# EAGLE design pt100-daughterboard (EAGLE 5.11)
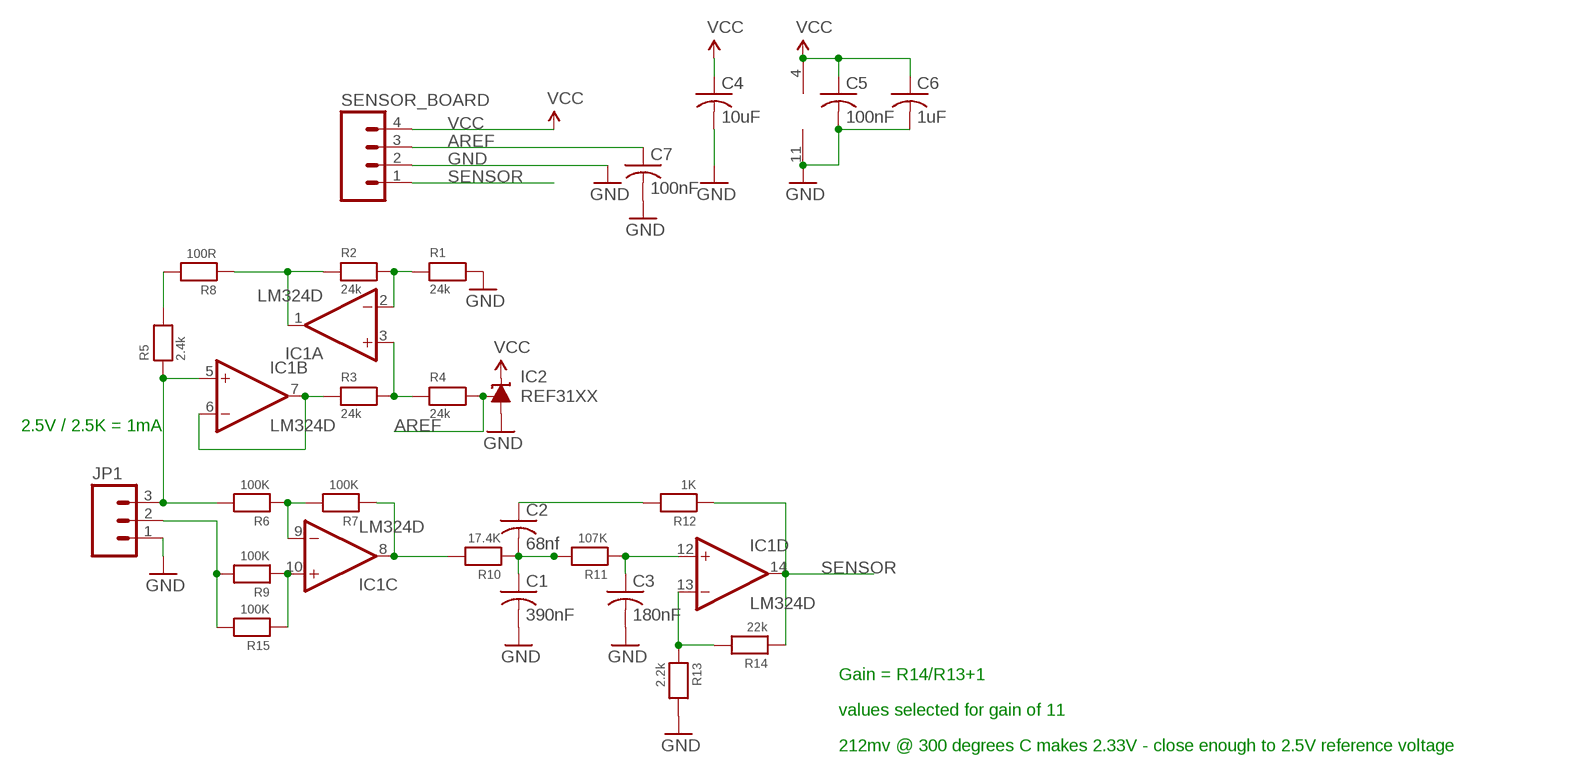
[diagram p0: schematic, sheet 1]

## Parts
C1  390nF  C-USC0603  [C0603]
C2  68nf  C-USC0603  [C0603]
C3  180nF  C-USC0603  [C0603]
C4  10uF  C-USC0805  [C0805]
C5  100nF  C-USC0603  [C0603]
C6  1uF  C-USC0603  [C0603]
C7  100nF  C-USC0603  [C0603]
IC1  LM324D  [SO14]
IC2  REF31XX  [DBZ_R-PDSO-G3]
JP1  M03LONGPADS  [1X03_LONGPADS]
R1  24k  RESISTOR0603  [0603]
R2  24k  RESISTOR0603  [0603]
R3  24k  RESISTOR0603  [0603]
R4  24k  RESISTOR0603  [0603]
R5  2.4k  RESISTOR0603  [0603]
R6  100K  RESISTOR0603  [0603]
R7  100K  RESISTOR0603  [0603]
R8  100R  RESISTOR0603  [0603]
R9  100K  RESISTOR0603  [0603]
R10  17.4K  RESISTOR0603  [0603]
R11  107K  RESISTOR0603  [0603]
R12  1K  RESISTOR0603  [0603]
R13  2.2k  RESISTOR0603  [0603]
R14  22k  RESISTOR0603  [0603]
R15  100K  RESISTOR0603  [0603]
SENSOR_BOARD  M04  [04P]

## Nets
AREF: C7.1 IC2.2(OUT) R4.2 SENSOR_BOARD.3
GND: C1.2 C3.2 C4.2 C5.2 C6.2 C7.2 IC1.11(P:V-) IC2.3(GND) JP1.1 R1.2 R13.2 SENSOR_BOARD.2
N$1: IC1.2(A:-IN) R1.1 R2.2
N$2: IC1.1(A:OUT) R2.1 R8.1
N$3: IC1.3(A:+IN) R3.2 R4.1
N$4: IC1.6(B:-IN) IC1.7(B:OUT) R3.1
N$5: IC1.5(B:+IN) JP1.3 R5.1 R6.2
N$6: IC1.9(C:-IN) R6.1 R7.2
N$7: IC1.8(C:OUT) R7.1 R10.2
N$8: IC1.10(C:+IN) R9.1 R15.1
N$9: JP1.2 R9.2 R15.2
N$11: IC1.13(D:-IN) R13.1 R14.2
N$12: C1.1 C2.2 R10.1 R11.2
N$13: C3.1 IC1.12(D:+IN) R11.1
N$14: C2.1 R12.2
N$30: R5.2 R8.2
SENSOR: IC1.14(D:OUT) R12.1 R14.1 SENSOR_BOARD.1
VCC: C4.1 C5.1 C6.1 IC1.4(P:V+) IC2.1(IN) SENSOR_BOARD.4

## Notes on the sheet
- 2.5V / 2.5K = 1mA
- Gain = R14/R13+1
- values selected for gain of 11
- 212mv @ 300 degrees C makes 2.33V - close enough to 2.5V reference voltage

## Library data of the parts
C1-C7 = adafruit:C-US: CAPACITOR, American symbol
IC1 = linear:LM324: OP AMP
IC2 = mic-misc:REF31XX: 20ppm/Degrees C Max, 100uA, SOT23-3 Series Voltage Reference http://www.ti.com/lit/gpn/ref3125
JP1 = SparkFun:M03: Header 3 Standard 3-pin 0.1" header. Use with straight break away headers (SKU : PRT-00116), right angle break away headers (PRT-00553), swiss pins (PRT-00743), machine pins (PRT-00117), and female headers (PRT-00115). Molex polarized connector foot print use with SKU : PRT-08232 with associated crimp pins and housings.
R1-R15 = microbuilder:RESISTOR: Resistors 0402 - 0402 Surface Mount Package 22 Ohm 1% 1/16W [Digikey: 311-22.0LRTR-ND] 33 Ohm 5% 1/16W 1.0K 5% 1/16W 1.5K 5% 1/16W 2.0K 1% 1/16W 10.0K 1% 1/16W [Digikey: 311-10.0KLRTR-ND] 10.0K 5% 1/16W [Digikey: RMCF0402JT10K0TR-ND] 12.1K 1% 1/16W [Digikey: 311-22.0LRTR-ND] 100.0K 5% 1/16W 0603 - 0603 Surface Mount Package 0 Ohm 1/10 Watt 1% Resistor 15 Ohm 1/10 Watt 1% Resistor 33 Ohm 1/10 Watt 1% Resistor 49.9 Ohm 1/10 Watt 1% Resistor 100 Ohm 1/10 Watt 1% Resistor 150 Ohm 1/10 Watt 1% Resistor 240 Ohm 1/10 Watt 1% Resistor 390 Ohm 1/10 Watt 1% Resistor 560 Ohm 1/10 Watt 1% Resistor 680 Ohm 1/10 Watt 1% Resistor 750 Ohm 1/10 Watt 1% Resistor 1.0K Ohm 1/10 Watt 1% Resistor 1.5K Ohm 1/10 Watt 1% Resistor 2.0K Ohm 1/10 Watt 1% Resistor 2.2K Ohm 1/10 Watt 1% Resistor 3.3K Ohm 1/10 Watt 1% Resistor 4.7K Ohm 1/10 Watt 1% Resistor 10.0K Ohm 1/10 Watt 1% Resistor 12.0K Ohm 1/10 Watt 1% Resistor 12.1K Ohm 1/10 Watt 1% Resistor 20.0K Ohm 1/10 Watt 1% Resistor 33.0K Ohm 1/10 Watt 1% Resistor 100.0K Ohm 1/10 Watt 1% Resistor 0805 - 0805 Surface Mount Package 0 Ohm 1/8 Watt 1% Resistor 33 Ohm 1/8 Watt 1% Resistor 100 Ohm 1/8 Watt 1% Resistor 150 Ohm 1/8 Watt 1% Resistor 200 Ohm 1/8 Watt 1% Resistor 240 Ohm 1/8 Watt 1% Resistor 330 Ohm 1/8 Watt 1% Resistor 390 Ohm 1/8 Watt 1% Resistor 470 Ohm 1/8 Watt 1% Resistor 1.0K Ohm 1/8 Watt 1% Resistor 1.5K Ohm 1/8 Watt 1% Resistor 2.0K Ohm 1/8 Watt 1% Resistor 4.7K Ohm 1/8 Watt 1% Resistor 5.1K Ohm 1/8 Watt 1% Resistor 5.6K Ohm 1/8 Watt 1% Resistor 10.0K Ohm 1/8 Watt 1% Resistor 22.0K Ohm 1/8 Watt 1% Resistor 33.0K Ohm 1/8 Watt 1% Resistor 100K Ohm 1/8 Watt 1% Resistor 1206 - 1206 Surface Mount Package 2012 - 2010 Surface Mount Package 0.11 Ohm 1/2 Watt 1% Resistor - Digikey: RHM.11UCT-ND
SENSOR_BOARD = con-amp-quick:M04: AMP QUICK CONNECTOR; OC_FARNELL: unknown; OC_NEWARK: unknown

## Board
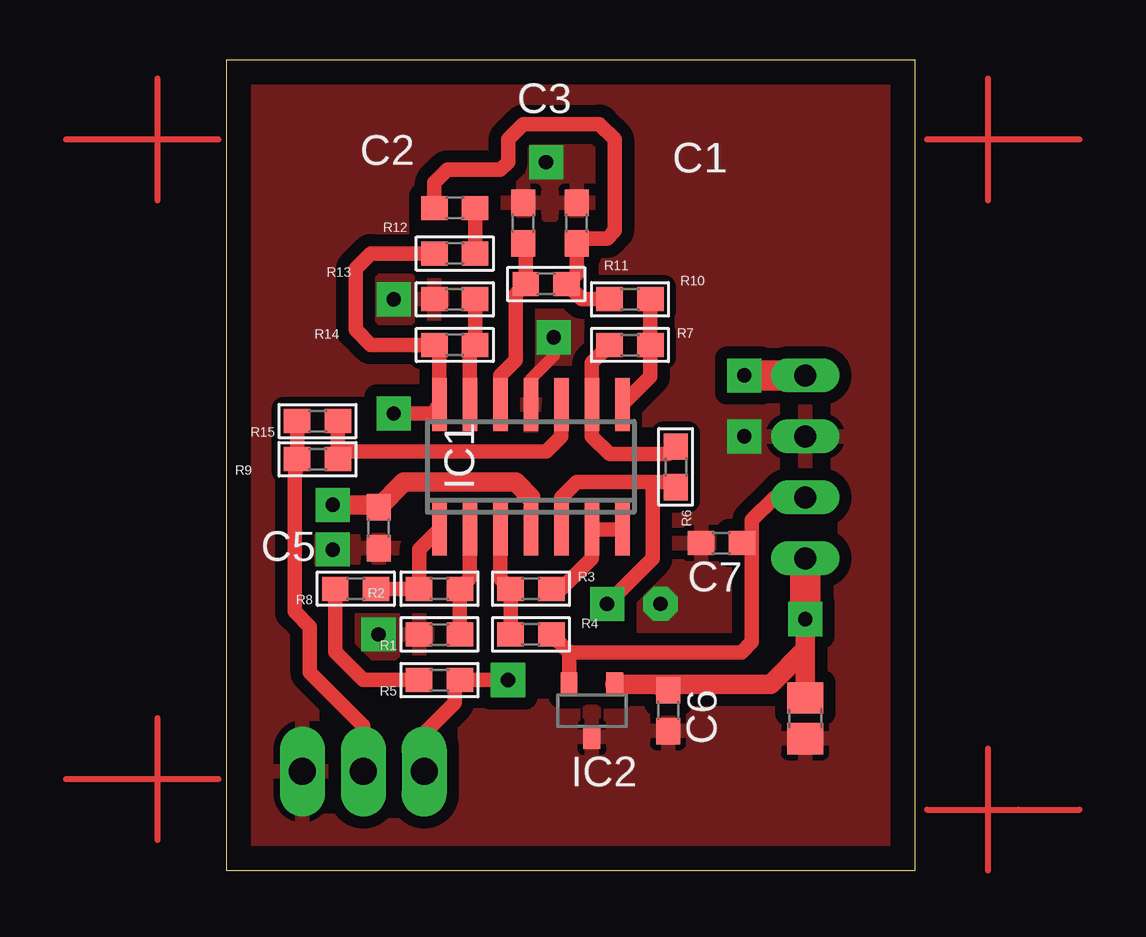
[diagram p1: board, top side]
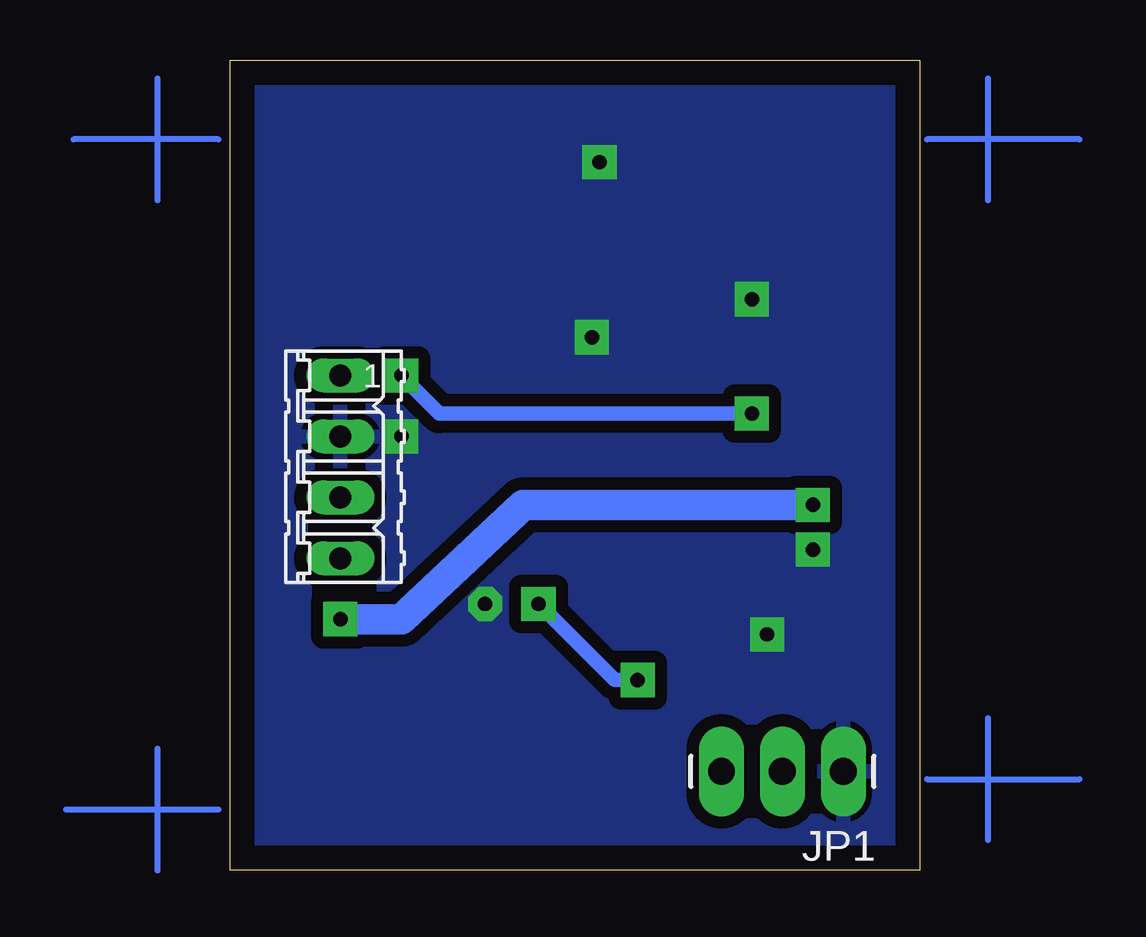
[diagram p2: board, bottom side, seen from below]

Size 28.71 x 33.79 mm. Coordinates in mm from the lower left corner, seen from the top.
Outline: 0,0 28.71,0 28.71,33.79 0,33.79 0,0
Copper layers (1*16): Top 0.035mm / dielectric 1.5mm / Bottom 0.035mm
Design rules "default *": minimum track width 10mil, minimum drill 24mil, track to track 16mil, track to pad 16mil, pad to pad 16mil, via to via 16mil, smd to smd 8mil, copper to edge 40mil, drill to drill 8mil, minimum pad ring 10mil, minimum via ring 8mil, stop-mask expansion 4mil, vias tented up to drill 0mil, thermal gap 10mil

### Footprints (pad centres in the part's own frame; a part is rotated, then mirrored left to right if it is on the bottom)
C0603 = smd 1.1 x 1: 1 -0.85,0; 2 0.85,0
C0805 = smd 1.3 x 1.5: 1 -0.85,0; 2 0.85,0
SO14 = smd 0.6 x 2.2: 1 -3.81,-2.6; 2 -2.54,-2.6; 3 -1.27,-2.6; 4 0,-2.6; 5 1.27,-2.6; 6 2.54,-2.6; 7 3.81,-2.6; 8 3.81,2.6; 9 2.54,2.6; 10 1.27,2.6; 11 0,2.6; 12 -1.27,2.6; 13 -2.54,2.6; 14 -3.81,2.6
DBZ_R-PDSO-G3 = smd 0.7 x 1: 1 -0.95,-1.1; 2 0.95,-1.1; 3 0,1.1
1X03_LONGPADS = drill 1.118 pad 1.88 long: 1 0,0; 2 2.54,0; 3 5.08,0
0603 = smd 1.1 x 1: 1 -0.85,0; 2 0.85,0
04P = drill 0.914 long: 1 -3.81,0; 2 -1.27,0; 3 1.27,0; 4 3.81,0

### Placement (x,y rotation side)
C1  14.61,26.99 90 top
C2  9.53,27.62 180 top
C3  12.38,26.99 90 top
C4  24.13,6.35 270 top
C5  6.35,14.29 270 top
C6  18.41,6.67 270 top
C7  20.64,13.65 180 top
IC1  12.7,16.83 0 top
IC2  15.24,6.67 180 top
JP1  3.17,4.13 180 bottom
R1  8.89,9.84 180 top
R2  8.89,11.75 0 top
R3  12.7,11.75 180 top
R4  12.7,9.84 0 top
R5  8.89,7.94 180 top
R6  18.73,16.83 270 top
R7  16.83,21.91 180 top
R8  5.4,11.75 180 top
R9  3.81,17.14 180 top
R10  16.83,23.81 0 top
R11  13.34,24.45 0 top
R12  9.53,25.72 0 top
R13  9.53,23.81 180 top
R14  9.53,21.91 0 top
R15  3.81,18.73 180 top
SENSOR_BOARD  24.13,16.83 270 bottom

### Tracks (layer width: path | path; a pad name or v marks a point on that pad's centre or on a via)
AREF
  Top 0.61: IC2.2 14.29,9.1 | 14.29,9.1 R4.2 | 14.29,9.1 21.48,9.1 21.91,9.53 21.91,13.97 | 21.91,13.97 21.91,14.61 22.86,15.56 SENSOR_BOARD.3 | C7.1 21.59,13.65 21.91,13.97
GND  (via drill 0.6 pad 1.42)
  Top 0.508: IC1.11 12.7,20.5 13.67,21.47 13.67,22.21 v13.65,22.23
  other vias: 6.99,23.81 13.34,29.53 6.35,9.84 4.45,13.38 21.59,18.1 18.1,11.11
  pour Top (isolate 0.508): -1.27,34.29 29.21,34.29 29.21,0 -1.27,0
  pour Bottom (isolate 0.508): -1.27,34.29 29.21,34.29 29.21,0 -1.27,0
N$1
  Top 0.61: IC1.2 10.16,12.17 R2.2 R1.1
N$2
  Top 0.61: IC1.1 8.04,13.38 R2.1 R8.1
N$3
  Top 0.61: IC1.3 11.43,12.17 R3.2 R4.1
N$4
  Top 0.61: R3.1 13.97,11.75 15.24,13.02 IC1.6 IC1.7
N$5  (via drill 0.6 pad 1.42)
  Top 0.61: IC1.5 13.97,15.56 14.61,16.19 17.78,16.19 | 17.78,16.19 18.84,16.19 R6.2 | v11.75,7.94 R5.1 9.53,7.72 9.53,6.99 8.26,5.71 JP1.3 | v15.88,11.11 17.78,13.02 17.78,16.19
  Bottom 0.61: v11.75,7.94 12.7,7.94 v15.88,11.11
N$6
  Top 0.61: R7.2 15.24,21.17 IC1.9 15.24,18.1 15.98,17.36 18.41,17.36 R6.1
N$7
  Top 0.61: IC1.8 17.68,20.59 R7.1 R10.2
N$8
  Top 0.61: IC1.10 13.97,18.1 13.34,17.46 4.76,17.46 4.66,17.36 | R9.1 4.66,17.36 | 4.66,17.36 R15.1
N$9
  Top 0.61: JP1.2 5.71,6.03 3.49,8.26 3.49,10.16 2.86,10.79 2.86,16.41 R9.2 R15.2
N$10
  Top 0.254: -2.86,27.94 -2.86,33.02
N$11
  Top 0.61: IC1.13 10.16,21.69 R14.2 R13.1
N$12
  Top 0.61: C2.2 8.68,28.68 9.21,29.21 11.43,29.21 11.75,29.53 11.75,30.48 12.38,31.11 15.56,31.11 16.19,30.48 16.19,26.67 15.88,26.35 14.82,26.35 C1.1 14.61,24.87 R11.2 14.82,23.81 R10.1
N$13
  Top 0.61: C3.1 12.48,26.04 R11.1 12.06,24.03 12.06,21.27 11.43,20.64 IC1.12
N$14
  Top 0.61: C2.1 R12.2
N$15
  Top 0.254: -6.67,30.48 -0.32,30.48
N$16
  Top 0.254: 31.75,27.94 31.75,33.02
N$17
  Top 0.254: 29.21,30.48 31.75,30.48 33.02,30.48 35.56,30.48
N$18
  Top 0.254: -2.86,1.27 -2.86,6.35
N$19
  Top 0.254: -0.32,3.81 -6.67,3.81
N$20
  Top 0.254: 31.75,0 31.75,5.08
N$21
  Top 0.254: 29.21,2.54 31.75,2.54 33.02,2.54 35.56,2.54
N$22
  Bottom 0.254: -2.86,27.94 -2.86,33.02
N$23
  Bottom 0.254: -6.67,30.48 -0.32,30.48
N$24
  Bottom 0.254: -2.86,1.27 -2.86,6.35
N$25
  Bottom 0.254: -0.32,3.81 -6.67,3.81
N$26
  Bottom 0.254: 31.75,0 31.75,5.08
N$27
  Bottom 0.254: 29.21,2.54 35.56,2.54
N$28
  Bottom 0.254: 31.75,27.94 31.75,33.02
N$29
  Bottom 0.254: 29.21,30.48 35.24,30.48
N$30
  Top 0.61: R8.2 4.55,9.11 5.71,7.94 R5.2
SENSOR  (via drill 0.6 pad 1.42)
  Top 0.61: R12.1 6.03,25.72 5.4,25.08 5.4,22.54 6.03,21.91 R14.1 8.89,21.69 IC1.14 8.63,19.05 v6.99,19.05
  Top 1.27: v21.59,20.64 SENSOR_BOARD.1
  Bottom 0.61: v6.99,19.05 20,19.05 v21.59,20.64
VCC  (via drill 0.6 pad 1.42)
  Top 0.508: C6.1 18.03,7.52 17.78,7.77
  Top 0.61: 12.7,15.56 IC1.4 | C5.1 6.25,15.24 | v24.13,10.48 24.13,10.16
  Top 0.813: 12.7,15.56 12.06,16.19 7.41,16.19 C5.1 | 6.25,15.24 v4.45,15.24 | IC2.1 17.78,7.77 22.69,7.77 24.13,9.21 | 24.13,10.16 24.13,9.21 | 24.13,9.21 C4.1
  Top 1.27: v24.13,10.48 SENSOR_BOARD.4
  Bottom 1.27: v4.45,15.24 16.51,15.24 21.59,10.48 v24.13,10.48